# EAGLE schematic I2C buttons (EAGLE 7.6.0)
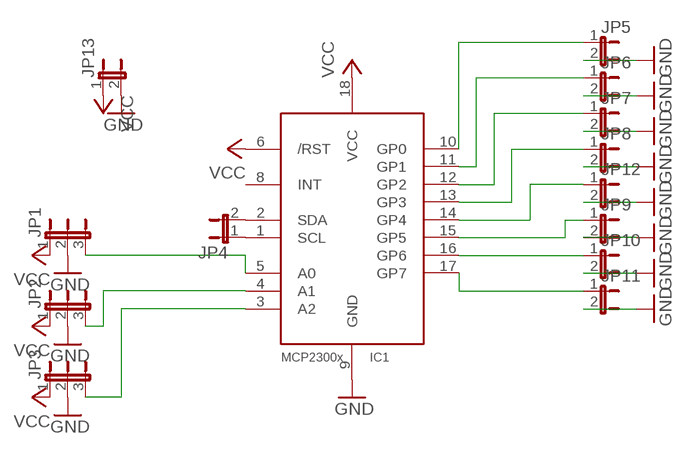
[diagram p0: schematic, sheet 1]

## Parts
IC1  MCP23008/P  [DIL18]
JP1  JP2E  [JP2]
JP2  JP2E  [JP2]
JP3  JP2E  [JP2]
JP4  JP1E  [JP1]
JP5  JP1E  [JP1]
JP6  JP1E  [JP1]
JP7  JP1E  [JP1]
JP8  JP1E  [JP1]
JP9  JP1E  [JP1]
JP10  JP1E  [JP1]
JP11  JP1E  [JP1]
JP12  JP1E  [JP1]
JP13  JP1E  [JP1]

## Nets
GND: IC1.9(GND) JP1.2 JP2.2 JP3.2 JP5.2 JP6.2 JP7.2 JP8.2 JP9.2 JP10.2 JP11.2 JP12.2 JP13.2
N$1: IC1.1(SCL) JP4.1
N$2: IC1.2(SDA) JP4.2
N$3: IC1.10(GP0) JP5.1
N$4: IC1.11(GP1) JP6.1
N$5: IC1.12(GP2) JP7.1
N$6: IC1.13(GP3) JP8.1
N$7: IC1.14(GP4) JP12.1
N$8: IC1.15(GP5) JP9.1
N$9: IC1.5(A0) JP1.3
N$10: IC1.4(A1) JP2.3
N$11: IC1.3(A2) JP3.3
N$12: IC1.16(GP6) JP10.1
N$13: IC1.17(GP7) JP11.1
VCC: IC1.6(/RST) IC1.18(VCC) JP1.1 JP2.1 JP3.1 JP13.1
Unconnected: IC1.8(INT)

## Library data of the parts
IC1 = adafruit:MCP23008: MCP23008 Inexpensive i2c i/o expander - 8 general purpose i/o pins with optional pullups
JP1-JP3 = jumper:JP2E: JUMPER
JP4-JP13 = jumper:JP1E: JUMPER